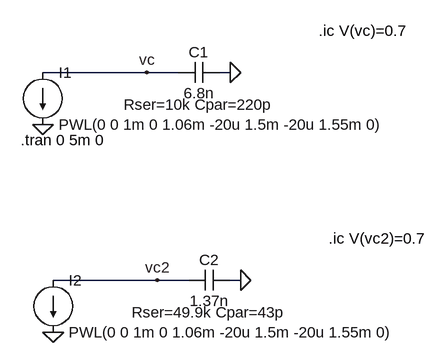
[diagram p0: schematic vc current understanding.asc]
vc current understanding.asc, the LTspice schematic file:
Version 4
SHEET 1 880 680
WIRE 208 160 48 160
WIRE 256 160 208 160
WIRE 336 160 320 160
WIRE 224 480 64 480
WIRE 272 480 224 480
WIRE 352 480 336 480
FLAG 336 160 0
FLAG 48 240 0
FLAG 208 160 vc
FLAG 352 480 0
FLAG 64 560 0
FLAG 224 480 vc2
SYMBOL cap 256 176 R270
WINDOW 3 0 32 VBottom 2
WINDOW 123 -36 32 VBottom 2
WINDOW 39 -18 32 VBottom 2
WINDOW 0 32 32 VTop 2
SYMATTR Value 6.8n
SYMATTR SpiceLine Rser=10k Cpar=220p
SYMATTR InstName C1
SYMBOL current 48 160 R0
WINDOW 123 0 0 Left 0
WINDOW 39 0 0 Left 0
SYMATTR InstName I1
SYMATTR Value PWL(0 0 1m 0 1.06m -20u 1.5m -20u 1.55m 0)
SYMBOL cap 272 496 R270
WINDOW 3 0 32 VBottom 2
WINDOW 123 -36 32 VBottom 2
WINDOW 39 -18 32 VBottom 2
WINDOW 0 32 32 VTop 2
SYMATTR Value 1.37n
SYMATTR SpiceLine Rser=49.9k Cpar=43p
SYMATTR InstName C2
SYMBOL current 64 480 R0
WINDOW 123 0 0 Left 0
WINDOW 39 0 0 Left 0
SYMATTR InstName I2
SYMATTR Value PWL(0 0 1m 0 1.06m -20u 1.5m -20u 1.55m 0)
TEXT 472 96 Left 2 !.ic V(vc)=0.7
TEXT 14 264 Left 2 !.tran 0 5m 0
TEXT 488 416 Left 2 !.ic V(vc2)=0.7

The netlist it stands for:
* vc current understanding.asc
C1 vc 0 6.8n Rser=10k Cpar=220p
I1 vc 0 PWL(0 0 1m 0 1.06m -20u 1.5m -20u 1.55m 0)
C2 vc2 0 1.37n Rser=49.9k Cpar=43p
I2 vc2 0 PWL(0 0 1m 0 1.06m -20u 1.5m -20u 1.55m 0)
.ic V(vc)=0.7
.tran 0 5m 0
.ic V(vc2)=0.7
.backanno
.end